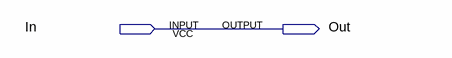
[diagram p0: schematic sheet]
// Quartus schematic Pass.bdf as structural Verilog: 0 symbols, 2 pins
module Pass (
  input  In,
  output Out
);


  assign Out = In;
endmodule
